# Altium schematic sheet 17 EDP.SchDoc
size 420 x 297 mm; Address1: Address1; Address2: Address2; Address3: Address3; Address4: Address4; DocumentNumber: АБВГ.123456.001 Э3; SheetNumber: 17; SheetTotal: 23; Scale: 1:1; DocumentType: Схема электрическая принципиальная; FirstReferrence: АБВГ.123456.001
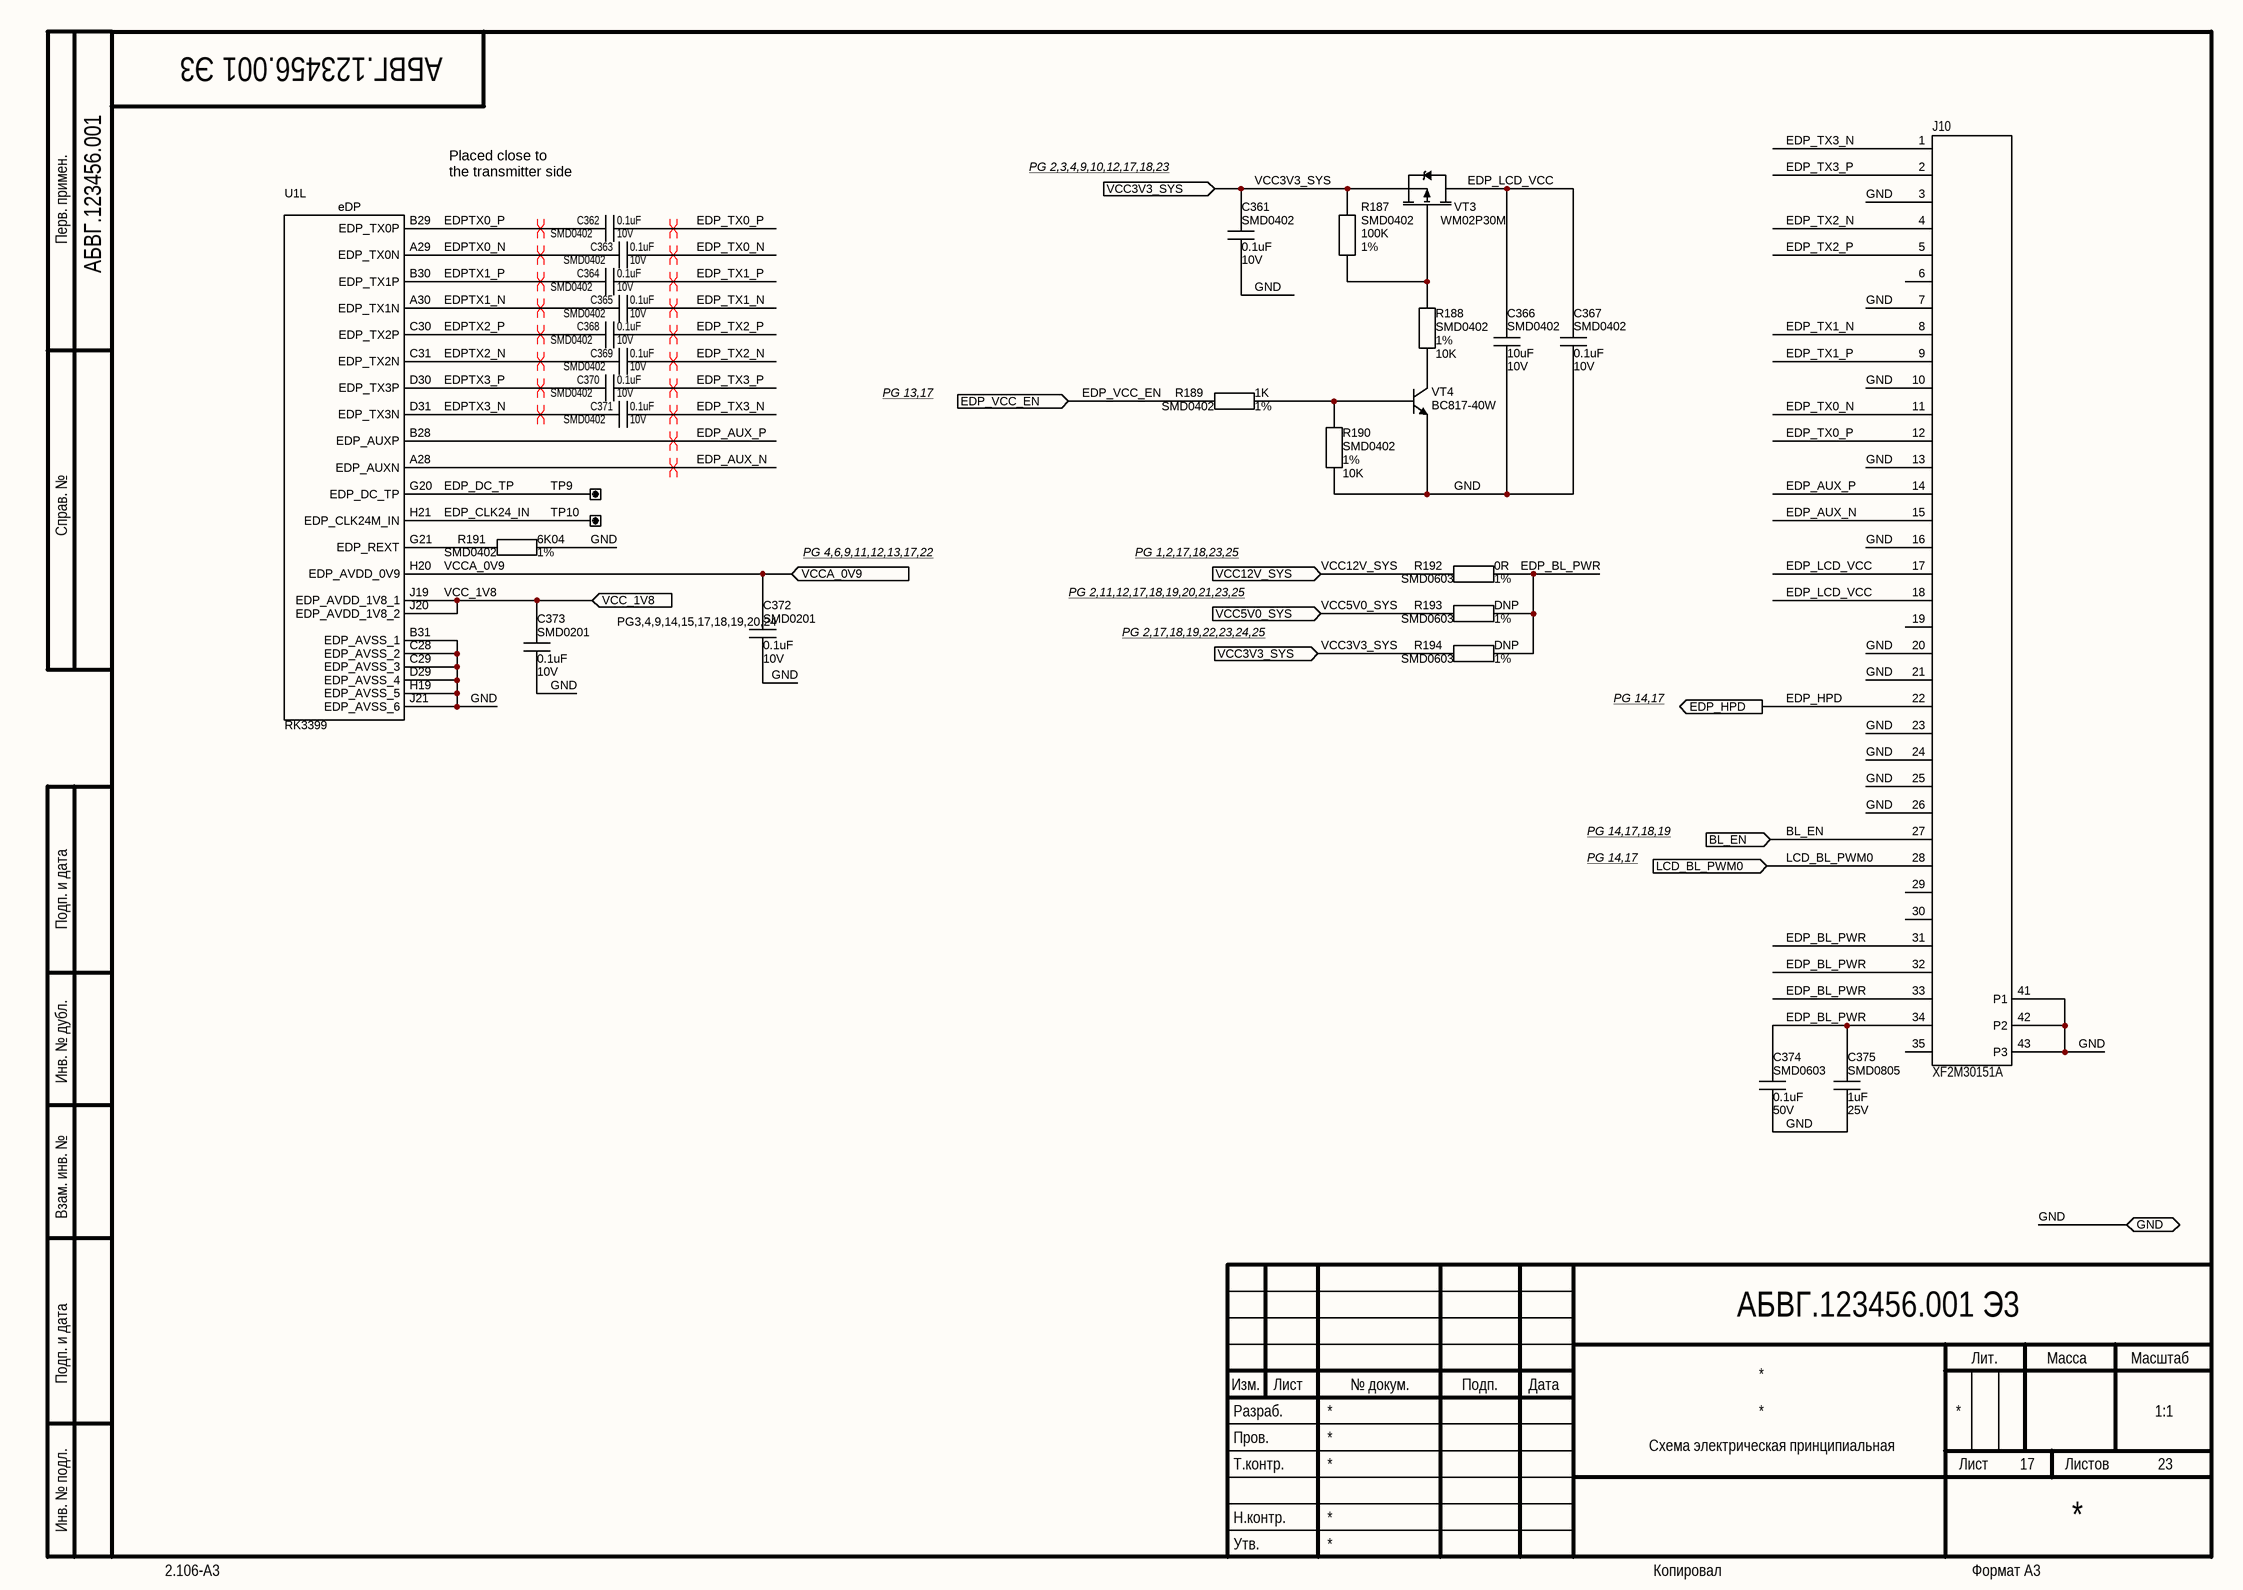
[diagram p0: 17 EDP.SchDoc]

## Parts
C361  Package: SMD0402  Voltage: 10V  [CAP_SMD_0402]  (hidden comment: 0.1uF)
C362  Package: SMD0402  Voltage: 10V  [CAP_SMD_0402_small]  (hidden comment: 0.1uF)
C363  Package: SMD0402  Voltage: 10V  [CAP_SMD_0402_small]  (hidden comment: 0.1uF)
C364  Package: SMD0402  Voltage: 10V  [CAP_SMD_0402_small]  (hidden comment: 0.1uF)
C365  Package: SMD0402  Voltage: 10V  [CAP_SMD_0402_small]  (hidden comment: 0.1uF)
C366  Package: SMD0402  Voltage: 10V  [CAP_SMD_0402]  (hidden comment: 10uF)
C367  Package: SMD0402  Voltage: 10V  [CAP_SMD_0402]  (hidden comment: 0.1uF)
C368  Package: SMD0402  Voltage: 10V  [CAP_SMD_0402_small]  (hidden comment: 0.1uF)
C369  Package: SMD0402  Voltage: 10V  [CAP_SMD_0402_small]  (hidden comment: 0.1uF)
C370  Package: SMD0402  Voltage: 10V  [CAP_SMD_0402_small]  (hidden comment: 0.1uF)
C371  Package: SMD0402  Voltage: 10V  [CAP_SMD_0402_small]  (hidden comment: 0.1uF)
C372  Package: SMD0201  Voltage: 10V  [CAP_SMD_0201]  (hidden comment: 0.1uF)
C373  Package: SMD0201  Voltage: 10V  [CAP_SMD_0201]  (hidden comment: 0.1uF)
C374  Package: SMD0603  Voltage: 50V  [CAP_SMD_0603]  (hidden comment: 0.1uF)
C375  Package: SMD0805  Voltage: 25V  [CAP_SMD_0805]  (hidden comment: 1uF)
J10  XF2M30151A  [XF2M-30_3515-1A]
R187  Package: SMD0402  Tolerance: 1%  [RES_SMD_0402]  (hidden comment: 100K)
R188  Package: SMD0402  Tolerance: 1%  [RES_SMD_0402]  (hidden comment: 10K)
R189  Package: SMD0402  Tolerance: 1%  [RES_SMD_0402]  (hidden comment: 1K)
R190  Package: SMD0402  Tolerance: 1%  [RES_SMD_0402]  (hidden comment: 10K)
R191  Package: SMD0402  Tolerance: 1%  [RES_SMD_0402]  (hidden comment: 6K04)
R192  Package: SMD0603  Tolerance: 1%  [RES_SMD_0603]  (hidden comment: 0R)
R193  Package: SMD0603  Tolerance: 1%  [RES_SMD_0603]  (hidden comment: DNP)
R194  Package: SMD0603  Tolerance: 1%  [RES_SMD_0603]  (hidden comment: DNP)
TP9  TEST POINT SMD 1MM  [TEST POINT SMD 1MM]  (value not drawn)
TP10  TEST POINT SMD 1MM  [TEST POINT SMD 1MM]  (value not drawn)
U1  value RK3399  [BGA828C65P31X31_2100X2100X161N]  (hidden comment: RK3399_FF)  (part L of 23)
VT3  value WM02P30M  [SOT23]  (hidden comment: Value)
VT4  BC817-40W  [SC-70]

## Ports
BL_EN (in), EDP_HPD (out), EDP_VCC_EN (in), GND (bidir), LCD_BL_PWM0 (in), VCC3V3_SYS (in), VCC5V0_SYS (in), VCC12V_SYS (in), VCC_1V8 (in), VCCA_0V9 (in)

## Nets
BL_EN: J10.27 ; port BL_EN
EDP_AUX_N: J10.15 U1.A28(EDP_AUXN)
EDP_AUX_P: J10.14 U1.B28(EDP_AUXP)
EDP_BL_PWR: C374.2 C375.2 J10.31 J10.32 J10.33 J10.34 R192.1 R193.1 R194.1
EDP_CLK24_IN: TP10.1 U1.H21(EDP_CLK24M_IN)
EDP_DC_TP: TP9.1 U1.G20(EDP_DC_TP)
EDP_HPD: J10.22 ; port EDP_HPD
EDP_LCD_VCC: C366.1 C367.1 J10.17 J10.18 VT3.3(D)
EDP_TX0_N: C363.1 J10.11
EDP_TX0_P: C362.1 J10.12
EDP_TX1_N: C365.1 J10.8
EDP_TX1_P: C364.1 J10.9
EDP_TX2_N: C369.1 J10.4
EDP_TX2_P: C368.1 J10.5
EDP_TX3_N: C371.1 J10.1
EDP_TX3_P: C370.1 J10.2
EDP_VCC_EN: R189.1 ; port EDP_VCC_EN
EDPTX0_N: C363.2 U1.A29(EDP_TX0N)
EDPTX0_P: C362.2 U1.B29(EDP_TX0P)
EDPTX1_N: C365.2 U1.A30(EDP_TX1N)
EDPTX1_P: C364.2 U1.B30(EDP_TX1P)
EDPTX2_N: C369.2 U1.C31(EDP_TX2N)
EDPTX2_P: C368.2 U1.C30(EDP_TX2P)
EDPTX3_N: C371.2 U1.D31(EDP_TX3N)
EDPTX3_P: C370.2 U1.D30(EDP_TX3P)
GND: C361.2 C366.2 C367.2 C372.2 C373.2 C374.1 C375.1 J10.3 J10.7 J10.10 J10.13 J10.16 J10.20 J10.21 J10.23 J10.24 J10.25 J10.26 J10.41(P1) J10.42(P2) J10.43(P3) R190.1 R191.2 U1.B31(EDP_AVSS_1) U1.C28(EDP_AVSS_2) U1.C29(EDP_AVSS_3) U1.D29(EDP_AVSS_4) U1.H19(EDP_AVSS_5) U1.J21(EDP_AVSS_6) VT4.2(E) ; port GND
LCD_BL_PWM0: J10.28 ; port LCD_BL_PWM0
VCC3V3_SYS: C361.1 R187.2 R194.2 VT3.2(S) ; port VCC3V3_SYS
VCC5V0_SYS: R193.2 ; port VCC5V0_SYS
VCC12V_SYS: R192.2 ; port VCC12V_SYS
VCC_1V8: C373.1 U1.J19(EDP_AVDD_1V8_1) U1.J20(EDP_AVDD_1V8_2) ; port VCC_1V8
VCCA_0V9: C372.1 U1.H20(EDP_AVDD_0V9) ; port VCCA_0V9
NetR187_1: R187.1 R188.2 VT3.1(G)
NetR188_1: R188.1 VT4.3(C)
NetR189_2: R189.2 R190.2 VT4.1(B)
NetR191_1: R191.1 U1.G21(EDP_REXT)

Not connected (* = marked no-connect by the designer): J10 6 19 29 30 35

## Layout directives
differential pair; net class DiffPair_90_Ohms; differential pair class DiffPair_90_Ohms: EDP_AUX_N, EDP_AUX_P, EDP_TX0_N, EDP_TX0_P, EDP_TX1_N, EDP_TX1_P, EDP_TX2_N, EDP_TX2_P, EDP_TX3_N, EDP_TX3_P, EDPTX0_N, EDPTX0_P, EDPTX1_N, EDPTX1_P, EDPTX2_N, EDPTX2_P, EDPTX3_N, EDPTX3_P

## Notes on the sheet
- Placed close to
  the transmitter side
- PG 2,3,4,9,10,12,17,18,23
- Перв. примен.
- PG 13,17
- Справ. №
- PG 4,6,9,11,12,13,17,22
- PG 2,11,12,17,18,19,20,21,23,25
- PG 1,2,17,18,23,25
- (near C372) PG3,4,9,14,15,17,18,19,20,24
- PG 2,17,18,19,22,23,24,25
- PG 14,17
- PG 14,17,18,19
- Подп. и дата
- Инв. № дубл.
- Взам. инв. №
- Разраб.
- Изм.
- Лист
- № докум.
- Подп.
- Дата
- Лит.
- Масса
- Масштаб
- Пров.
- Т.контр.
- Листов
- Инв. № подл.
- Утв.
- Н.контр.
- 2.106-A3
- Копировал
- Формат А3
- (in symbol RK3399_FF, part L) eDP

## Library data of the parts
C361-C365 C367-C371 = Ceramic_Cap: PartNumber: CC0402KRX5R6BB104; ComponentType: SMD Ceramic Chip Capacitor; Manufacter: *; Tolerance: *; Value: 0.1uF
  C361 C367: ClassName: *
  C362-C365 C368-C371: ClassName: Solder_Clearence
C366 = Ceramic_Cap: PartNumber: CC0402MRX5R6BB106; ComponentType: SMD Ceramic Chip Capacitor; Manufacter: *; Tolerance: *; ClassName: *; Value: 10uF
C372 C373 = Ceramic_Cap: PartNumber: CC0201KRX5R6BB104; ComponentType: SMD Ceramic Chip Capacitor; Manufacter: *; Tolerance: *; ClassName: *; Value: 0.1uF
C374 = Ceramic_Cap: PartNumber: CC0603KRX7R9BB104; ComponentType: SMD Ceramic Chip Capacitor; Manufacter: *; Tolerance: *; ClassName: *; Value: 0.1uF
C375 = Ceramic_Cap: PartNumber: CC0805KKX7R8BB105; ComponentType: SMD Ceramic Chip Capacitor; Manufacter: *; Tolerance: *; ClassName: *; Value: 1uF
J10 = LCD_CON_30_35: ComponentType: *; Manufacter: *; Package: XF2M30151A; PartNumber: XF2M30151A; ClassName: *; Value: XF2M30151A
R187 = Chip_Res: PartNumber: RC0402FR-07100KL; ComponentType: SMD Chip Resistor; Manufacter: *; Voltage: *; ClassName: *; Value: 100K
R188 R190 = Chip_Res: PartNumber: RC0402FR-0710KL; ComponentType: SMD Chip Resistor; Manufacter: *; Voltage: *; ClassName: *; Value: 10K
R189 = Chip_Res: PartNumber: RC0402FR-071KL; ComponentType: SMD Chip Resistor; Manufacter: *; Voltage: *; ClassName: *; Value: 1K
R191 = Chip_Res: PartNumber: RC0402FR-076K04L; ComponentType: SMD Chip Resistor; Manufacter: *; Voltage: *; ClassName: *; Value: 6K04
R192-R194 = Chip_Res: PartNumber: RC0603FR-070RL; ComponentType: SMD Chip Resistor; Manufacter: *; Voltage: *; ClassName: *
  R192: Value: 0R
  R193 R194: Value: DNP
TP9 TP10 = TP: ComponentType: *; Manufacter: *; Package: TEST POINT SMD 1MM; PartNumber: TEST POINT SMD 1MM; ClassName: *; Value: TEST POINT SMD 1MM
VT3 = MOSFET_P: ComponentType: *; Manufacter: *; Package: SOT23; PartNumber: WM02P30M; ClassName: *
VT4 = NPN_BEC: ComponentType: *; Manufacter: *; Package: SC-70; PartNumber: BC817-40W; ClassName: *; Value: BC817-40W
U1 = RK3399_FF: Package: BGA828; ComponentType: *; Manufacter: *; PartNumber: RK3399; ClassName: *